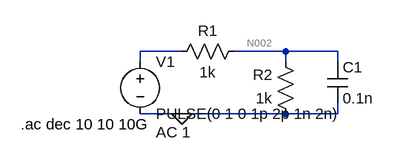
[diagram p0: schematic Draft8.asc]
Draft8.asc, the LTspice schematic file:
Version 4
SHEET 1 880 680
WIRE 48 112 -16 112
WIRE 208 112 128 112
WIRE 288 112 208 112
WIRE -16 128 -16 112
WIRE 208 128 208 112
WIRE 288 128 288 112
WIRE 48 208 -16 208
WIRE 208 208 48 208
WIRE 288 208 288 192
WIRE 288 208 208 208
FLAG 48 208 0
SYMBOL res 144 96 R90
WINDOW 0 0 56 VBottom 2
WINDOW 3 32 56 VTop 2
SYMATTR InstName R1
SYMATTR Value 1k
SYMBOL res 224 224 R180
WINDOW 0 36 76 Left 2
WINDOW 3 36 40 Left 2
SYMATTR InstName R2
SYMATTR Value 1k
SYMBOL cap 272 128 R0
SYMATTR InstName C1
SYMATTR Value 0.1n
SYMBOL voltage -16 112 R0
WINDOW 123 24 124 Left 2
WINDOW 39 0 0 Left 0
SYMATTR InstName V1
SYMATTR Value PULSE(0 1 0 1p 2p 1n 2n)
SYMATTR Value2 AC 1
TEXT -200 224 Left 2 !.ac dec 10 10 10G

The netlist it stands for:
* Draft8.asc
R1 N002 N001 1k
R2 0 N002 1k
C1 N002 0 0.1n
V1 N001 0 PULSE(0 1 0 1p 2p 1n 2n) AC 1
.ac dec 10 10 10G
.backanno
.end

* Results of the author's LTspice run, read from the files saved beside the schematic
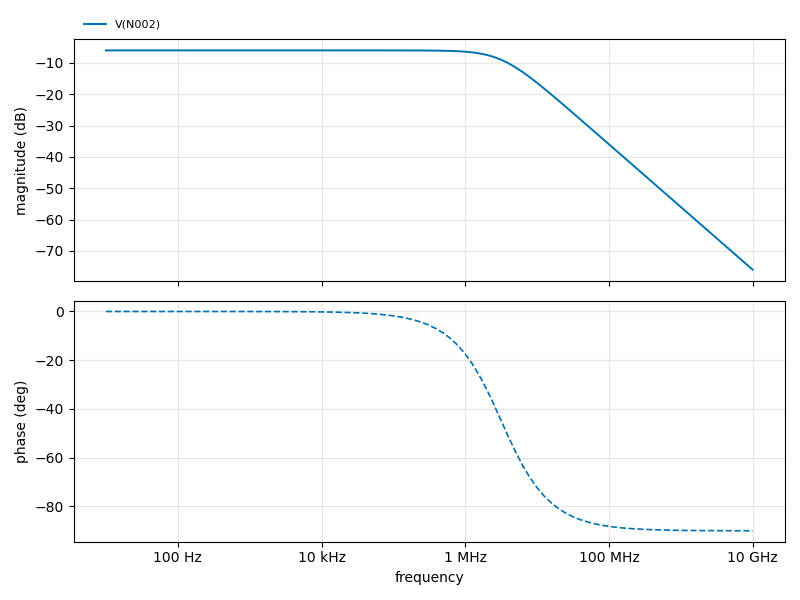
[diagram p1: AC Analysis of Draft8.asc, plotted from the saved traces]
* AC Analysis, 1 run:
*   V(N002): -6.02 dB at 10 Hz, -75.96 dB at 10 GHz, peak -6.02 dB at 10 Hz, 3 dB below the peak at 3.181 MHz